# Altium schematic sheet Power - 3V3_.SchDoc
size A4
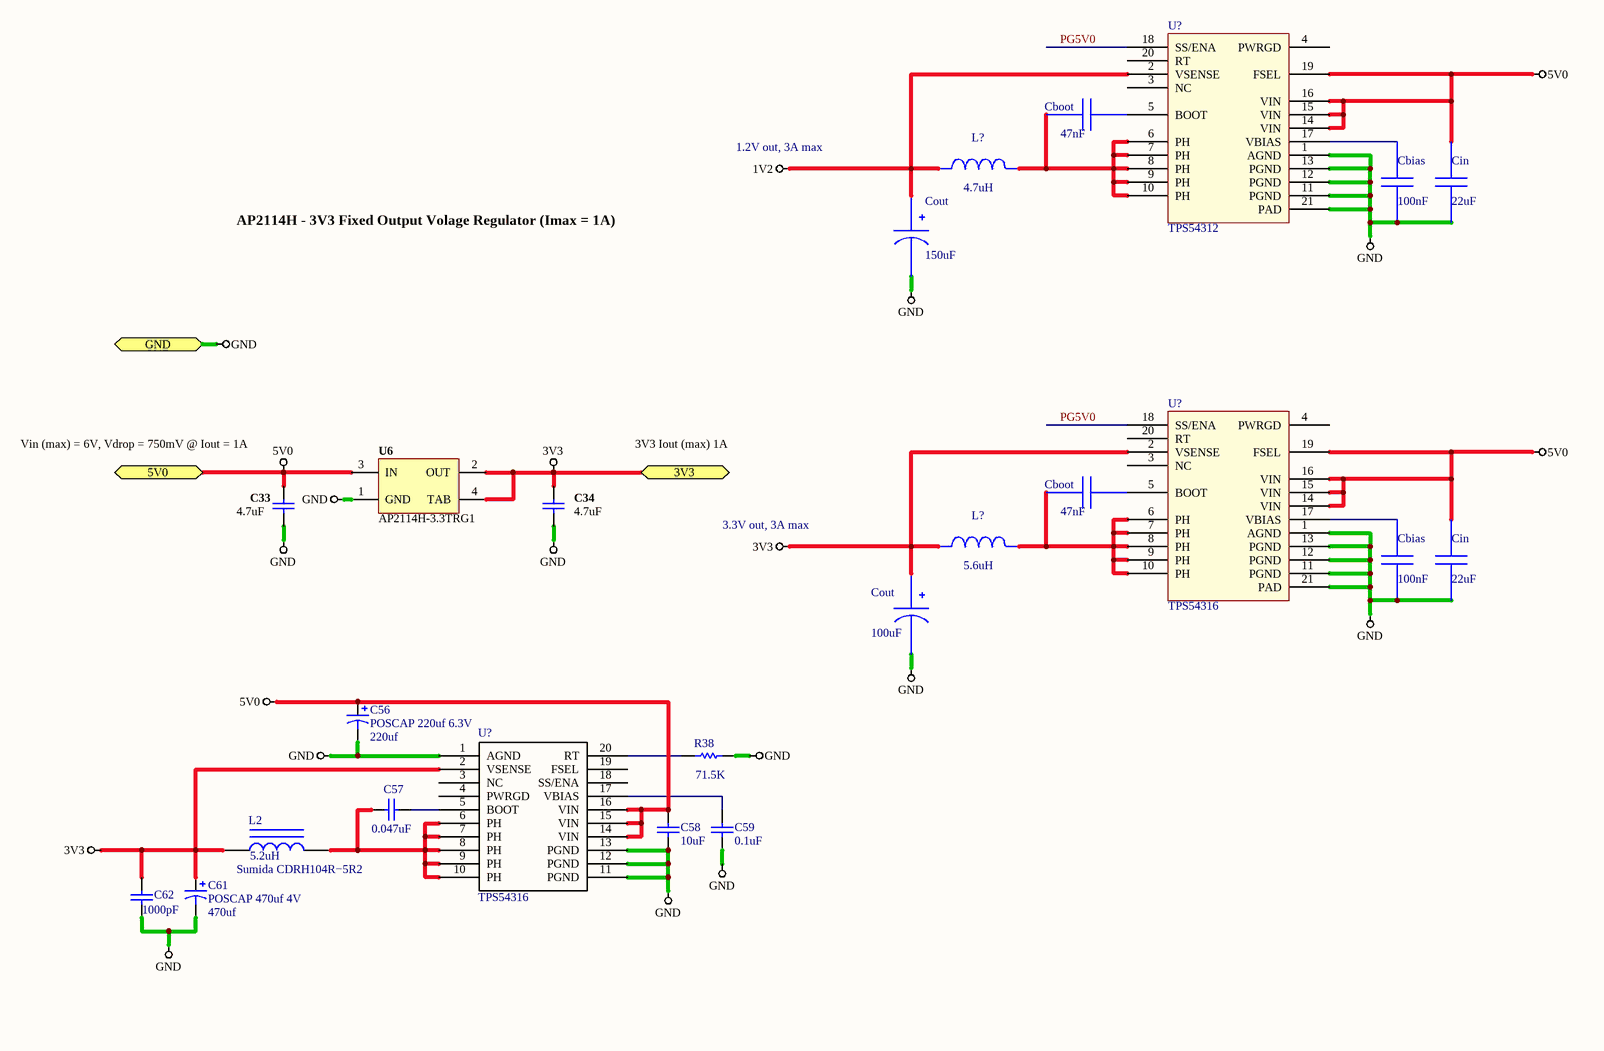
[diagram p0: Power - 3V3_.SchDoc]

## Parts
(Parts that share a designator on the sheet are numbered #1, #2 ... from top to bottom, then left to right.)
C33  value 4.7uF  [CAPC0603(1608)55_L]  (hidden comment: CAP 4.7uF 10V 0603(1608))
C34  value 4.7uF  [CAPC0603(1608)55_L]  (hidden comment: CAP 4.7uF 10V 0603(1608))
C56  POSCAP 220uf 6.3V  value 220uf  [C0805]
C57  value 0.047uF  [RAD-0.3]  (hidden comment: Cap)
C58  value 10uF  [RAD-0.3]  (hidden comment: Cap)
C59  value 0.1uF  [RAD-0.3]  (hidden comment: Cap)
C61  POSCAP 470uf 4V  value 470uf  [C0805]
C62  value 1000pF  [RAD-0.3]  (hidden comment: Cap)
Cbias#1  value 100nF  (hidden comment: C0603C104J3RAC)
Cbias#2  value 100nF  (hidden comment: C0603C104J3RAC)
Cboot#1  value 47nF  [0402]  (hidden comment: GRM155R71E473KA88D)
Cboot#2  value 47nF  (hidden comment: GRM155R71E473KA88D)
Cin#1  value 22uF  (hidden comment: C4532X7R1C226M)
Cin#2  value 22uF  (hidden comment: C4532X7R1C226M)
Cout#1  value 150uF  (hidden comment: TPSD157M010R0050)
Cout#2  value 100uF  (hidden comment: TPSD107M010R0080)
L2  Sumida CDRH104R−5R2  value 5.2uH  [AXIAL-0.9]
L?#1  value 4.7uH  [B82464G4]  (hidden comment: B82464G4472M)
L?#2  value 5.6uH  (hidden comment: 744071056)
R38  value 71.5K  [AXIAL-0.3]  (hidden comment: Res1)
U6  AP2114H-3.3TRG1  [SOT230P700X180-4L]
U?#1  TPS54312  [PWP20_3P4X2P4]
U?#2  TPS54316  [PWP20_3P4X2P4]
U?#3  TPS54316

## Ports
3V3, 5V0, GND

## Nets
1V2: Cout#1.1(+) L?#1.1 U?#1.2(VSENSE)
3V3: C34.1 C61.1 C62.1 Cout#2.1(+) L2.1 L?#2.1 U6.2(OUT) U6.4(TAB) U?#2.2(VSENSE) U?#3.2(VSENSE) ; port 3V3
5V0: C33.1 C56.1 C58.1 Cin#1.1 Cin#2.1 U6.3(IN) U?#1.14(VIN) U?#1.15(VIN) U?#1.16(VIN) U?#1.19(FSEL) U?#2.14(VIN) U?#2.15(VIN) U?#2.16(VIN) U?#2.19(FSEL) U?#3.14(VIN) U?#3.15(VIN) U?#3.16(VIN) ; port 5V0
GND: C33.2 C34.2 C56.2 C58.2 C59.2 C61.2 C62.2 Cbias#1.2 Cbias#2.2 Cin#1.2 Cin#2.2 Cout#1.2(-) Cout#2.2(-) R38.2 U6.1(GND) U?#1.1(AGND) U?#1.11(PGND) U?#1.12(PGND) U?#1.13(PGND) U?#1.21(PAD) U?#2.1(AGND) U?#2.11(PGND) U?#2.12(PGND) U?#2.13(PGND) U?#2.21(PAD) U?#3.1(AGND) U?#3.11(PGND) U?#3.12(PGND) U?#3.13(PGND) ; port GND
PG5V0: U?#1.18(SS/ENA) U?#2.18(SS/ENA)
NetC57_1: C57.1 U?#3.5(BOOT)
NetC57_2: C57.2 L2.2 U?#3.6(PH) U?#3.7(PH) U?#3.8(PH) U?#3.9(PH) U?#3.10(PH)
NetC59_1: C59.1 U?#3.17(VBIAS)
NetCbias#1_1: Cbias#1.1 U?#1.17(VBIAS)
NetCbias#2_1: Cbias#2.1 U?#2.17(VBIAS)
NetCboot#1_1: Cboot#1.1 U?#1.5(BOOT)
NetCboot#1_2: Cboot#1.2 L?#1.2 U?#1.6(PH) U?#1.7(PH) U?#1.8(PH) U?#1.9(PH) U?#1.10(PH)
NetCboot#2_1: Cboot#2.1 U?#2.5(BOOT)
NetCboot#2_2: Cboot#2.2 L?#2.2 U?#2.6(PH) U?#2.7(PH) U?#2.8(PH) U?#2.9(PH) U?#2.10(PH)
NetR38_1: R38.1 U?#3.20(RT)

Not connected (* = marked no-connect by the designer): U?#1 3(NC) 4(PWRGD) 20(RT); U?#2 3(NC) 4(PWRGD) 20(RT); U?#3 3(NC) 4(PWRGD) 18(SS/ENA) 19(FSEL)

## Notes on the sheet
- 1.2V out, 3A max
- AP2114H - 3V3 Fixed Output Volage Regulator (Imax = 1A)
- (near C33) Vin (max) = 6V, Vdrop = 750mV @ Iout = 1A
- 3V3 Iout (max) 1A
- 3.3V out, 3A max

## Library data of the parts
C33 C34 = CAP 4.7uF 10V ±10% 0603 (1608 Metric) Thickness 0.55mm SMD: Manufacturer_PN: CC0603KRX5R6BB475; Case-Metric: 1608; Case-EIA: 0603; Tolerance: ±10%; Rated Voltage: 10 V; Technology: SMT; Max Thickness: 0.55 mm; Manufacturer Part Number: CC0603KRX5R6BB475
C56 C61 = Cap Pol3: Polarized Capacitor (Surface Mount); Published: 8-Jun-2000; LatestRevisionDate: 29-May-2009; LatestRevisionNote: IPC-7351 Footprint Added.; PackageReference: C0805; Publisher: Altium Limited; PackageDescription: Chip Capacitor
C57-C59 C62 = Cap: Capacitor; Published: 8-Jun-2000; LatestRevisionDate: 17-Jul-2002; LatestRevisionNote: Re-released for DXP Platform.; PackageReference: RAD-0.3; Publisher: Altium Limited; PackageDescription: Radial Cap, Thru-Hole; 2 Leads; 0.3 in Pin Spacing
Cbias#1 Cbias#2 = C0603C104J3RAC: Manufacturer Name: Kemet; PackageReference: C0603C104J3RAC; Manufacturer Part Number: C0603C104J3RAC
Cboot#1 Cboot#2 = GRM155R71E473KA88D: GRM155R71E473KA8; Manufacturer Name: MuRata; PackageReference: GRM155R71E473KA88D; Manufacturer Part Number: GRM155R71E473KA88D
Cin#1 Cin#2 = C4532X7R1C226M: Manufacturer Name: TDK; PackageReference: C4532X7R1C226M; Manufacturer Part Number: C4532X7R1C226M
Cout#1 = TPSD157M010R0050: Manufacturer Name: AVX; PackageReference: TPSD157M010R0050; Manufacturer Part Number: TPSD157M010R0050
Cout#2 = TPSD107M010R0080: Manufacturer Name: AVX; PackageReference: TPSD107M010R0080; Manufacturer Part Number: TPSD107M010R0080
L2 = Inductor Iron: Magnetic-Core Inductor; Published: 24-Mar-1999; LatestRevisionDate: 17-Jul-2002; LatestRevisionNote: Re-released for DXP Platform.; PackageReference: AXIAL-0.9; Publisher: Altium Limited; PackageDescription: Axial Device, Thru-Hole; 2 Leads; 0.9 in Pin Spacing
L?#1 = B82464G4472M: Unknown; Manufacturer Name: TDK; PackageReference: B82464G4472M; Manufacturer Part Number: B82464G4472M
L?#2 = 744071056: Unknown; Manufacturer Name: Wurth Elektronik; PackageReference: 744071056; Manufacturer Part Number: 744071056
R38 = Res1: Resistor; Published: 8-Jun-2000; LatestRevisionDate: 17-Jul-2002; LatestRevisionNote: Re-released for DXP Platform.; PackageReference: AXIAL-0.3; Publisher: Altium Limited; PackageDescription: Axial Device, Thru-Hole; 2 Leads; 0.3 in Pin Spacing
U6 = AP2114H-3.3TRG1: AP2114, 1A Low Dropout Positive Fixed 3V3 Regulator; Max Input Voltage: 6V; Max Output Voltage: 3.34V; Min Input Voltage: -0.3V; Min Output Voltage: 3.25V; Supply Voltage: 5V; Max Output Current: 1A; Mounting Technology: Surface Mount; Status: Unreleased; Temperature Range: -40 - 125 degC; Category: IC-Power; Manufacturer_PN: AP2114H-3.3TRG1; Manufacturer Part Number: AP2114H-3.3TRG1
U?#1 U?#2 = TPS5431x